# EAGLE design UVBoard (EAGLE 7.4.0)
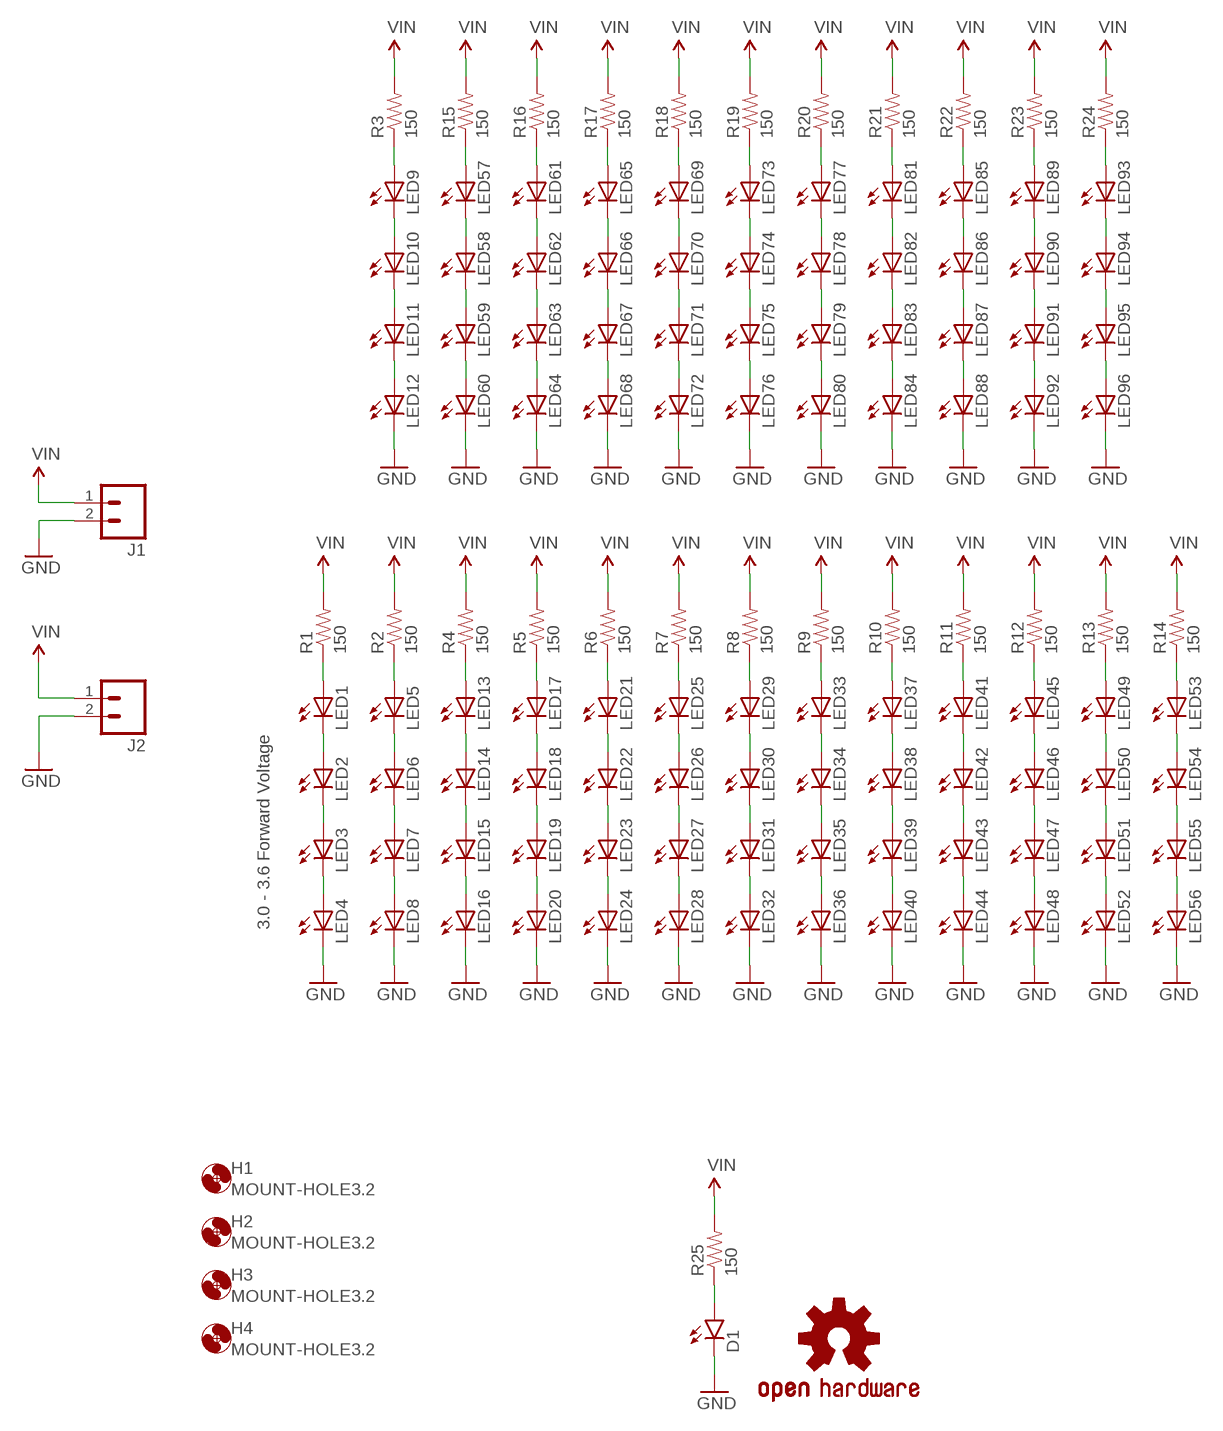
[diagram p0: schematic, sheet 1]

## Parts
D1  LED1206-BOTTOM  [LED-1206-BOTTOM]
H1  MOUNT-HOLE3.2  [3,2]
H2  MOUNT-HOLE3.2  [3,2]
H3  MOUNT-HOLE3.2  [3,2]
H4  MOUNT-HOLE3.2  [3,2]
J1  M023.5MM  [SCREWTERMINAL-3.5MM-2]
J2  M023.5MM  [SCREWTERMINAL-3.5MM-2]
LED1  LEDP-LCC-2  [P-LCC-2]
LED2  LEDP-LCC-2  [P-LCC-2]
LED3  LEDP-LCC-2  [P-LCC-2]
LED4  LEDP-LCC-2  [P-LCC-2]
LED5  LEDP-LCC-2  [P-LCC-2]
LED6  LEDP-LCC-2  [P-LCC-2]
LED7  LEDP-LCC-2  [P-LCC-2]
LED8  LEDP-LCC-2  [P-LCC-2]
LED9  LEDP-LCC-2  [P-LCC-2]
LED10  LEDP-LCC-2  [P-LCC-2]
LED11  LEDP-LCC-2  [P-LCC-2]
LED12  LEDP-LCC-2  [P-LCC-2]
LED13  LEDP-LCC-2  [P-LCC-2]
LED14  LEDP-LCC-2  [P-LCC-2]
LED15  LEDP-LCC-2  [P-LCC-2]
LED16  LEDP-LCC-2  [P-LCC-2]
LED17  LEDP-LCC-2  [P-LCC-2]
LED18  LEDP-LCC-2  [P-LCC-2]
LED19  LEDP-LCC-2  [P-LCC-2]
LED20  LEDP-LCC-2  [P-LCC-2]
LED21  LEDP-LCC-2  [P-LCC-2]
LED22  LEDP-LCC-2  [P-LCC-2]
LED23  LEDP-LCC-2  [P-LCC-2]
LED24  LEDP-LCC-2  [P-LCC-2]
LED25  LEDP-LCC-2  [P-LCC-2]
LED26  LEDP-LCC-2  [P-LCC-2]
LED27  LEDP-LCC-2  [P-LCC-2]
LED28  LEDP-LCC-2  [P-LCC-2]
LED29  LEDP-LCC-2  [P-LCC-2]
LED30  LEDP-LCC-2  [P-LCC-2]
LED31  LEDP-LCC-2  [P-LCC-2]
LED32  LEDP-LCC-2  [P-LCC-2]
LED33  LEDP-LCC-2  [P-LCC-2]
LED34  LEDP-LCC-2  [P-LCC-2]
LED35  LEDP-LCC-2  [P-LCC-2]
LED36  LEDP-LCC-2  [P-LCC-2]
LED37  LEDP-LCC-2  [P-LCC-2]
LED38  LEDP-LCC-2  [P-LCC-2]
LED39  LEDP-LCC-2  [P-LCC-2]
LED40  LEDP-LCC-2  [P-LCC-2]
LED41  LEDP-LCC-2  [P-LCC-2]
LED42  LEDP-LCC-2  [P-LCC-2]
LED43  LEDP-LCC-2  [P-LCC-2]
LED44  LEDP-LCC-2  [P-LCC-2]
LED45  LEDP-LCC-2  [P-LCC-2]
LED46  LEDP-LCC-2  [P-LCC-2]
LED47  LEDP-LCC-2  [P-LCC-2]
LED48  LEDP-LCC-2  [P-LCC-2]
LED49  LEDP-LCC-2  [P-LCC-2]
LED50  LEDP-LCC-2  [P-LCC-2]
LED51  LEDP-LCC-2  [P-LCC-2]
LED52  LEDP-LCC-2  [P-LCC-2]
LED53  LEDP-LCC-2  [P-LCC-2]
LED54  LEDP-LCC-2  [P-LCC-2]
LED55  LEDP-LCC-2  [P-LCC-2]
LED56  LEDP-LCC-2  [P-LCC-2]
LED57  LEDP-LCC-2  [P-LCC-2]
LED58  LEDP-LCC-2  [P-LCC-2]
LED59  LEDP-LCC-2  [P-LCC-2]
LED60  LEDP-LCC-2  [P-LCC-2]
LED61  LEDP-LCC-2  [P-LCC-2]
LED62  LEDP-LCC-2  [P-LCC-2]
LED63  LEDP-LCC-2  [P-LCC-2]
LED64  LEDP-LCC-2  [P-LCC-2]
LED65  LEDP-LCC-2  [P-LCC-2]
LED66  LEDP-LCC-2  [P-LCC-2]
LED67  LEDP-LCC-2  [P-LCC-2]
LED68  LEDP-LCC-2  [P-LCC-2]
LED69  LEDP-LCC-2  [P-LCC-2]
LED70  LEDP-LCC-2  [P-LCC-2]
LED71  LEDP-LCC-2  [P-LCC-2]
LED72  LEDP-LCC-2  [P-LCC-2]
LED73  LEDP-LCC-2  [P-LCC-2]
LED74  LEDP-LCC-2  [P-LCC-2]
LED75  LEDP-LCC-2  [P-LCC-2]
LED76  LEDP-LCC-2  [P-LCC-2]
LED77  LEDP-LCC-2  [P-LCC-2]
LED78  LEDP-LCC-2  [P-LCC-2]
LED79  LEDP-LCC-2  [P-LCC-2]
LED80  LEDP-LCC-2  [P-LCC-2]
LED81  LEDP-LCC-2  [P-LCC-2]
LED82  LEDP-LCC-2  [P-LCC-2]
LED83  LEDP-LCC-2  [P-LCC-2]
LED84  LEDP-LCC-2  [P-LCC-2]
LED85  LEDP-LCC-2  [P-LCC-2]
LED86  LEDP-LCC-2  [P-LCC-2]
LED87  LEDP-LCC-2  [P-LCC-2]
LED88  LEDP-LCC-2  [P-LCC-2]
LED89  LEDP-LCC-2  [P-LCC-2]
LED90  LEDP-LCC-2  [P-LCC-2]
LED91  LEDP-LCC-2  [P-LCC-2]
LED92  LEDP-LCC-2  [P-LCC-2]
LED93  LEDP-LCC-2  [P-LCC-2]
LED94  LEDP-LCC-2  [P-LCC-2]
LED95  LEDP-LCC-2  [P-LCC-2]
LED96  LEDP-LCC-2  [P-LCC-2]
LOGO1  OSHW-LOGOM  [OSHW-LOGO-M]
R1  150  RESISTOR1206  [1206]
R2  150  RESISTOR1206  [1206]
R3  150  RESISTOR1206  [1206]
R4  150  RESISTOR1206  [1206]
R5  150  RESISTOR1206  [1206]
R6  150  RESISTOR1206  [1206]
R7  150  RESISTOR1206  [1206]
R8  150  RESISTOR1206  [1206]
R9  150  RESISTOR1206  [1206]
R10  150  RESISTOR1206  [1206]
R11  150  RESISTOR1206  [1206]
R12  150  RESISTOR1206  [1206]
R13  150  RESISTOR1206  [1206]
R14  150  RESISTOR1206  [1206]
R15  150  RESISTOR1206  [1206]
R16  150  RESISTOR1206  [1206]
R17  150  RESISTOR1206  [1206]
R18  150  RESISTOR1206  [1206]
R19  150  RESISTOR1206  [1206]
R20  150  RESISTOR1206  [1206]
R21  150  RESISTOR1206  [1206]
R22  150  RESISTOR1206  [1206]
R23  150  RESISTOR1206  [1206]
R24  150  RESISTOR1206  [1206]
R25  150  RESISTOR1206  [1206]

## Nets
GND: D1.C J1.2 J2.2 LED4.C LED8.C LED12.C LED16.C LED20.C LED24.C LED28.C LED32.C LED36.C LED40.C LED44.C LED48.C LED52.C LED56.C LED60.C LED64.C LED68.C LED72.C LED76.C LED80.C LED84.C LED88.C LED92.C LED96.C
N$2: LED1.C LED2.A
N$3: LED2.C LED3.A
N$4: LED3.C LED4.A
N$5: LED1.A R1.1
N$6: LED5.C LED6.A
N$7: LED6.C LED7.A
N$8: LED7.C LED8.A
N$9: LED5.A R2.1
N$10: LED9.C LED10.A
N$11: LED10.C LED11.A
N$12: LED11.C LED12.A
N$13: LED9.A R3.1
N$14: LED13.C LED14.A
N$15: LED14.C LED15.A
N$16: LED15.C LED16.A
N$17: LED13.A R4.1
N$18: LED17.C LED18.A
N$19: LED18.C LED19.A
N$20: LED19.C LED20.A
N$21: LED17.A R5.1
N$22: LED21.C LED22.A
N$23: LED22.C LED23.A
N$24: LED23.C LED24.A
N$25: LED21.A R6.1
N$26: LED25.C LED26.A
N$27: LED26.C LED27.A
N$28: LED27.C LED28.A
N$29: LED25.A R7.1
N$30: LED29.C LED30.A
N$31: LED30.C LED31.A
N$32: LED31.C LED32.A
N$33: LED29.A R8.1
N$34: LED33.C LED34.A
N$35: LED34.C LED35.A
N$36: LED35.C LED36.A
N$37: LED33.A R9.1
N$38: LED37.C LED38.A
N$39: LED38.C LED39.A
N$40: LED39.C LED40.A
N$41: LED37.A R10.1
N$42: LED41.C LED42.A
N$43: LED42.C LED43.A
N$44: LED43.C LED44.A
N$45: LED41.A R11.1
N$46: LED45.C LED46.A
N$47: LED46.C LED47.A
N$48: LED47.C LED48.A
N$49: LED45.A R12.1
N$50: LED49.C LED50.A
N$51: LED50.C LED51.A
N$52: LED51.C LED52.A
N$53: LED49.A R13.1
N$54: LED53.C LED54.A
N$55: LED54.C LED55.A
N$56: LED55.C LED56.A
N$57: LED53.A R14.1
N$58: LED57.C LED58.A
N$59: LED58.C LED59.A
N$60: LED59.C LED60.A
N$61: LED57.A R15.1
N$62: LED61.C LED62.A
N$63: LED62.C LED63.A
N$64: LED63.C LED64.A
N$65: LED61.A R16.1
N$66: LED65.C LED66.A
N$67: LED66.C LED67.A
N$68: LED67.C LED68.A
N$69: LED65.A R17.1
N$70: LED69.C LED70.A
N$71: LED70.C LED71.A
N$72: LED71.C LED72.A
N$73: LED69.A R18.1
N$74: LED73.C LED74.A
N$75: LED74.C LED75.A
N$76: LED75.C LED76.A
N$77: LED73.A R19.1
N$78: LED77.C LED78.A
N$79: LED78.C LED79.A
N$80: LED79.C LED80.A
N$81: LED77.A R20.1
N$82: LED81.C LED82.A
N$83: LED82.C LED83.A
N$84: LED83.C LED84.A
N$85: LED81.A R21.1
N$86: LED85.C LED86.A
N$87: LED86.C LED87.A
N$88: LED87.C LED88.A
N$89: LED85.A R22.1
N$90: LED89.C LED90.A
N$91: LED90.C LED91.A
N$92: LED91.C LED92.A
N$93: LED89.A R23.1
N$94: LED93.C LED94.A
N$95: LED94.C LED95.A
N$96: LED95.C LED96.A
N$97: LED93.A R24.1
N$98: D1.A R25.1
VIN: J1.1 J2.1 R1.2 R2.2 R3.2 R4.2 R5.2 R6.2 R7.2 R8.2 R9.2 R10.2 R11.2 R12.2 R13.2 R14.2 R15.2 R16.2 R17.2 R18.2 R19.2 R20.2 R21.2 R22.2 R23.2 R24.2 R25.2

## Notes on the sheet
- 3.0 - 3.6 Forward Voltage

## Library data of the parts
D1 = SparkFun-LED:LED: LEDs Standard schematic elements and footprints for 5mm, 3mm, 1206, and 0603 sized LEDs. 5mm - Spark Fun Electronics SKU : COM-00529 (and others)
H1-H4 = holes:MOUNT-HOLE: MOUNTING HOLE with drill center marker
J1 J2 = SparkFun-Connectors:M02: Standard 2-pin 0.1" header. Use with - straight break away headers ( PRT-00116) - right angle break away headers (PRT-00553) - swiss pins (PRT-00743) - machine pins (PRT-00117) - female headers (PRT-00115) Molex polarized connector foot print use with: PRT-08233 with associated crimp pins and housings. 2.54_SCREWTERM for use with PRT-10571. 3.5mm Screw Terminal footprints for PRT-08084 5mm Screw Terminal footprints for use with PRT-08432; PROD_ID: CONN-08399
LED1-LED96 = led:LED: LED OSRAM: - CHIPLED LG R971, LG N971, LY N971, LG Q971, LY Q971, LO R971, LY R971 LH N974, LH R974 LS Q976, LO Q976, LY Q976 LO Q996 - Hyper CHIPLED LW Q18S LB Q993, LB Q99A, LB R99A - SideLED LS A670, LO A670, LY A670, LG A670, LP A670 LB A673, LV A673, LT A673, LW A673 LH A674 LY A675 LS A676, LA A676, LO A676, LY A676, LW A676 LS A679, LY A679, LG A679 - Hyper Micro SIDELED® LS Y876, LA Y876, LO Y876, LY Y876 LT Y87S - SmartLED LW L88C, LW L88S LB L89C, LB L89S, LG L890 LS L89K, LO L89K, LY L89K LS L896, LA L896, LO L896, LY L896 - TOPLED LS T670, LO T670, LY T670, LG T670, LP T670 LSG T670, LSP T670, LSY T670, LOP T670, LYG T670 LG T671, LOG T671, LSG T671 LB T673, LV T673, LT T673, LW T673 LH T674 LS T676, LA T676, LO T676, LY T676, LB T676, LH T676, LSB T676, LW T676 LB T67C, LV T67C, LT T67C, LS T67K, LO T67K, LY T67K, LW E67C LS E67B, LA E67B, LO E67B, LY E67B, LB E67C, LV E67C, LT E67C LW T67C LS T679, LY T679, LG T679 LS T770, LO T770, LY T770, LG T770, LP T770 LB T773, LV T773, LT T773, LW T773 LH T774 LS E675, LA E675, LY E675, LS T675 LS T776, LA T776, LO T776, LY T776, LB T776 LHGB T686 LT T68C, LB T68C - Hyper Mini TOPLED® LB M676 - Mini TOPLED Santana® LG M470 LS M47K, LO M47K, LY M47K Source: http://www.osram.convergy.de LUXEON: - LUMILED® LXK2-PW12-R00, LXK2-PW12-S00, LXK2-PW14-U00, LXK2-PW14-V00 LXK2-PM12-R00, LXK2-PM12-S00, LXK2-PM14-U00 LXK2-PE12-Q00, LXK2-PE12-R00, LXK2-PE12-S00, LXK2-PE14-T00, LXK2-PE14-U00 LXK2-PB12-K00, LXK2-PB12-L00, LXK2-PB12-M00, LXK2-PB14-N00, LXK2-PB14-P00, LXK2-PB14-Q00 LXK2-PR12-L00, LXK2-PR12-M00, LXK2-PR14-Q00, LXK2-PR14-R00 LXK2-PD12-Q00, LXK2-PD12-R00, LXK2-PD12-S00 LXK2-PH12-R00, LXK2-PH12-S00 LXK2-PL12-P00, LXK2-PL12-Q00, LXK2-PL12-R00 Source: www.luxeon.com KINGBRIGHT: KA-3528ASYC Source: www.kingbright.com
LOGO1 = Spark:OSHW-LOGO: Open Source Hardware Logo This logo indicates the piece of hardware it is found on incorporates a OSHW license and/or adheres to the definition of open source hardware found here: http://freedomdefined.org/OSHW
R1-R25 = SparkFun-Passives:RESISTOR: Resistor Basic schematic elements and footprints for 0603, 1206, and PTH resistors.

## Board
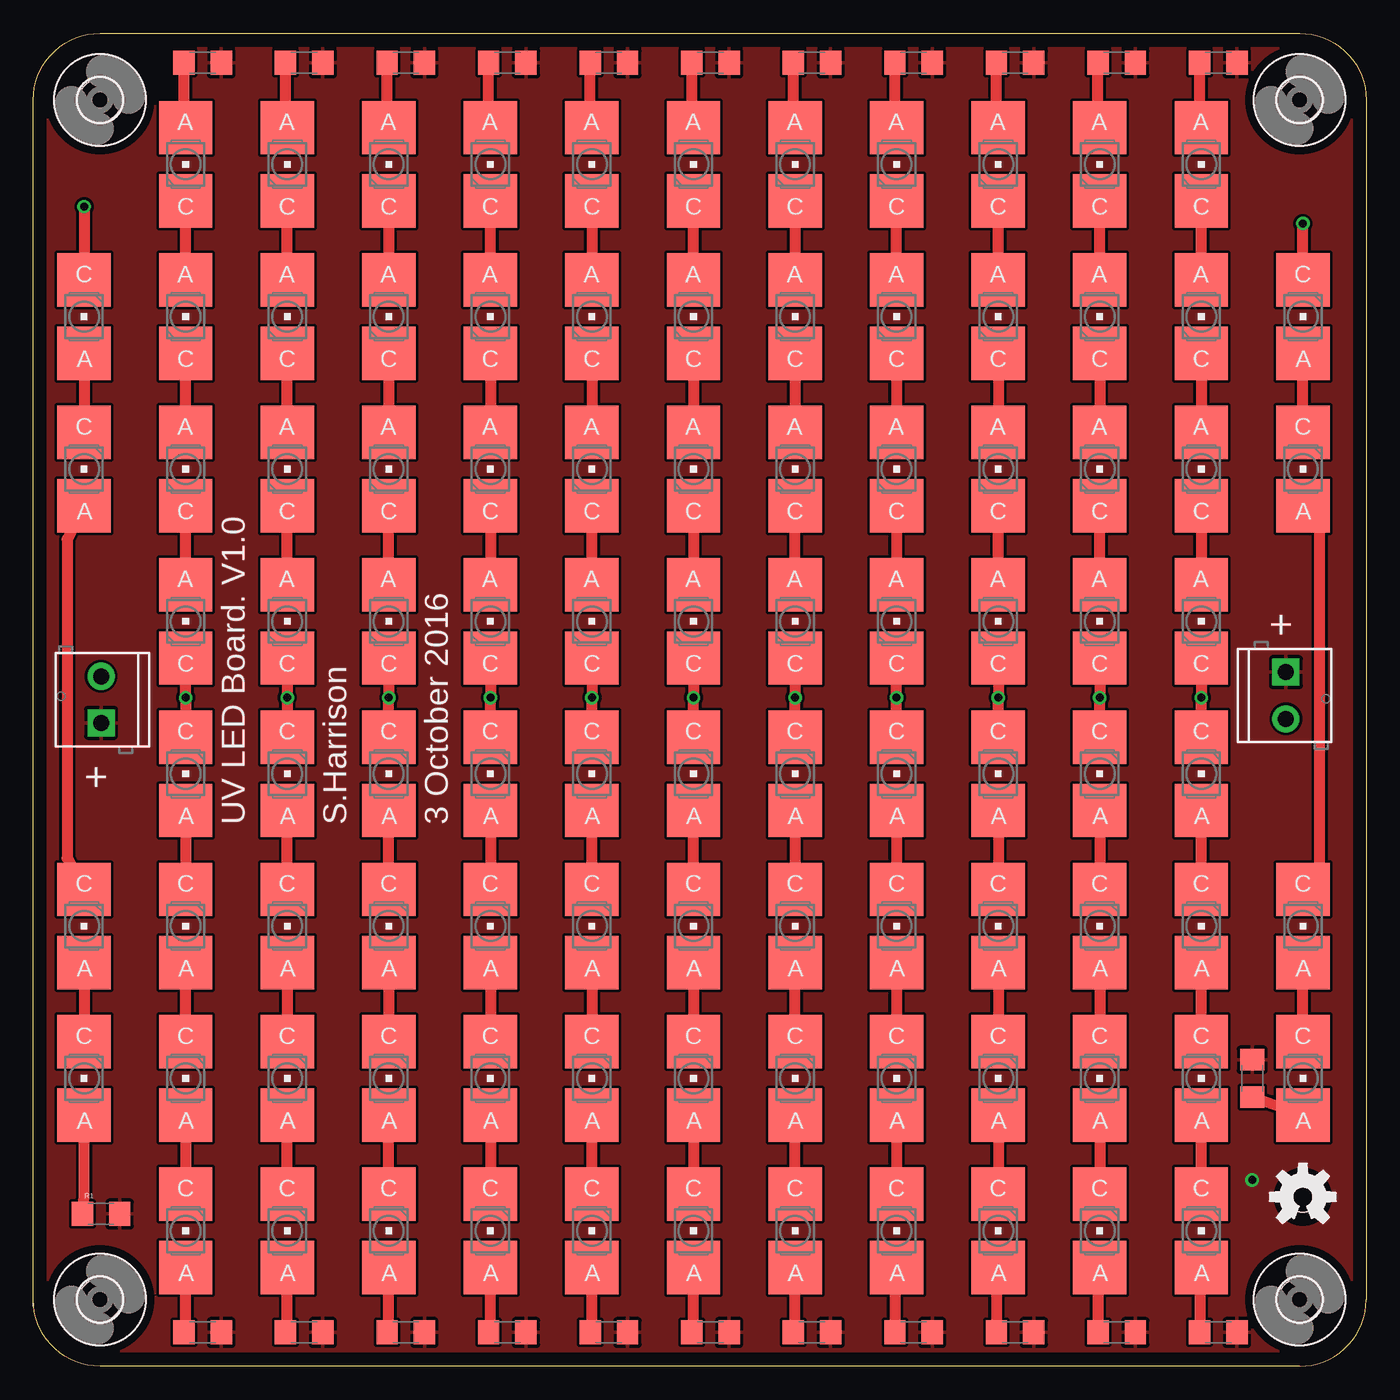
[diagram p1: board, top side]
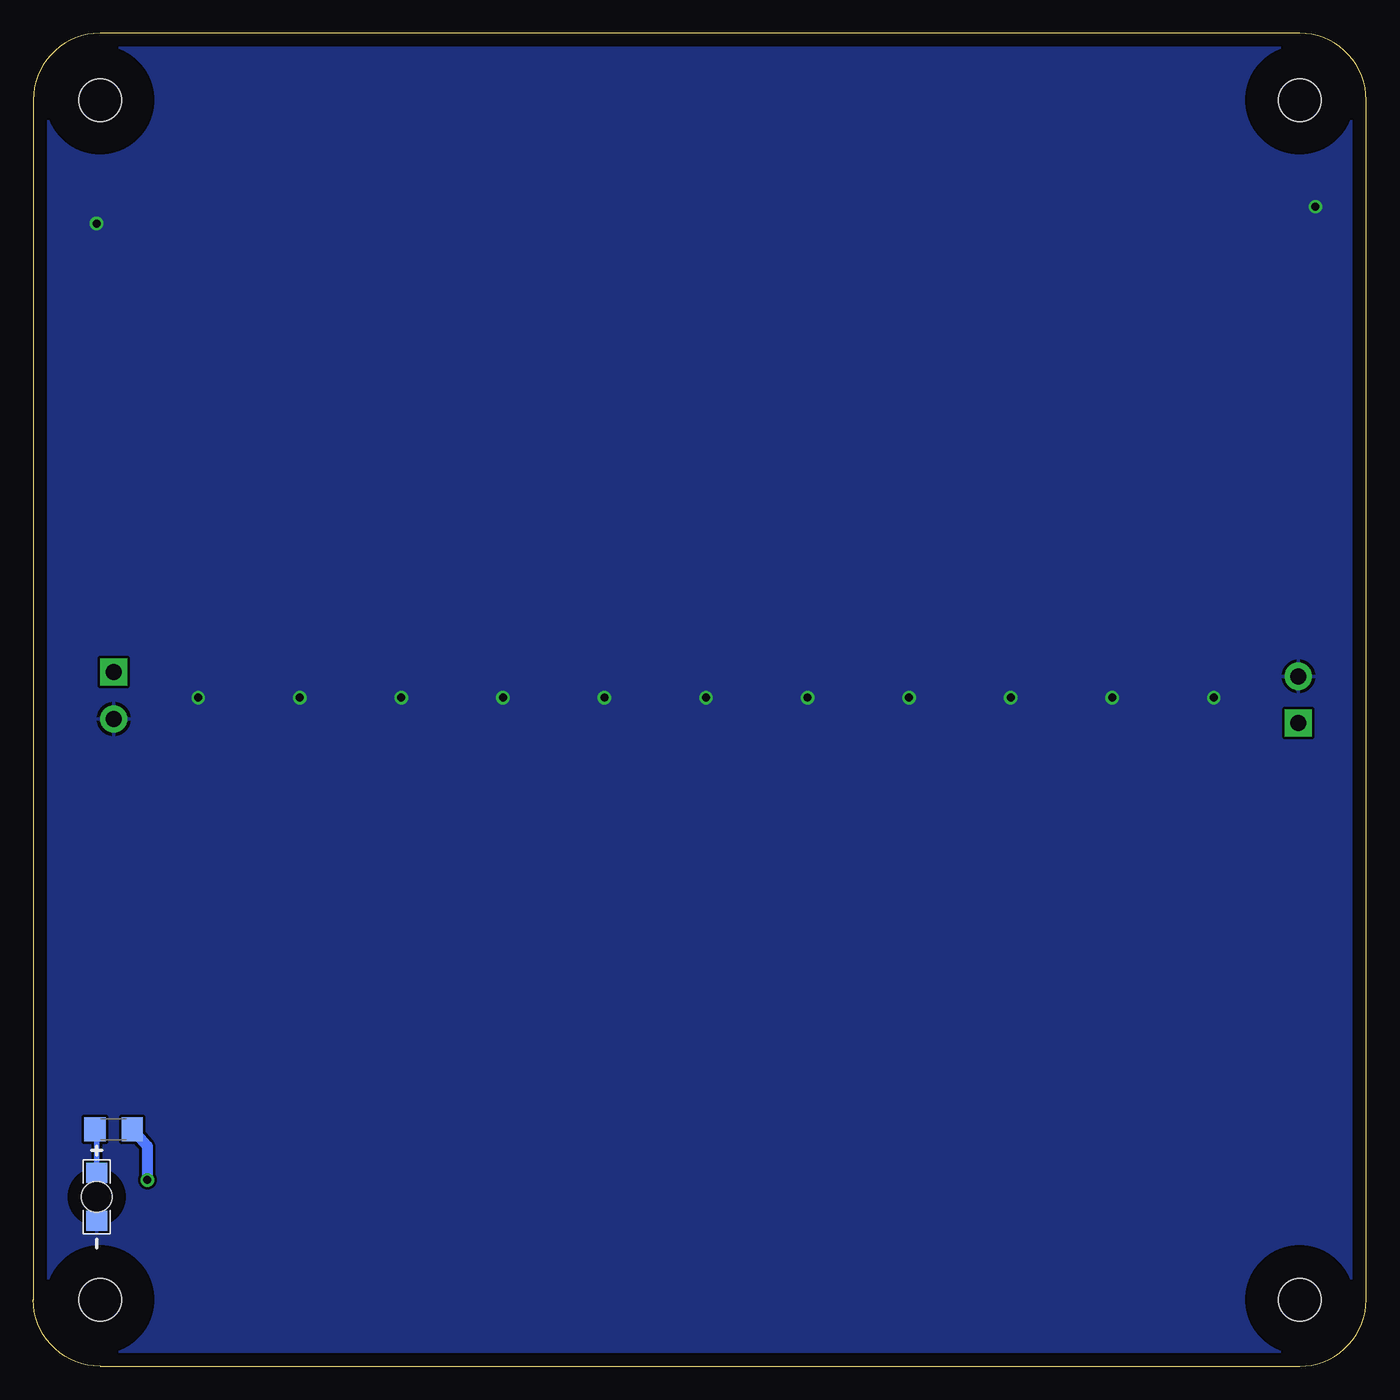
[diagram p2: board, bottom side, seen from below]

Size 100 x 100 mm. Coordinates in mm from the lower left corner, seen from the top.
Outline: 5,100 95,100 arc-90 100,95 100,5 arc-90 95,0 5,0 arc-90 0,5 0,95 arc-90 5,100
Copper layers (1*16): Top 0.035mm / dielectric 1.5mm / Bottom 0.035mm
Design rules "default": minimum track width 10mil, minimum drill 24mil, track to track 8mil, track to pad 8mil, pad to pad 8mil, via to via 8mil, smd to smd 8mil, copper to edge 40mil, drill to drill 8mil, minimum pad ring 10mil, minimum via ring 8mil, stop-mask expansion 4mil, vias tented up to drill 0mil, thermal gap 10mil

### Footprints (pad centres in the part's own frame; a part is rotated, then mirrored left to right if it is on the bottom)
LED-1206-BOTTOM = smd 1.5 x 1.6: A -1.8,0; C 1.8,0 | hole 2.3: 0,0
3,2 = hole 3.2: 0,0
SCREWTERMINAL-3.5MM-2 = drill 1.2 pad 2.032 square: 1 0,0 | drill 1.2 pad 2.032: 2 3.5,0
P-LCC-2 = smd 4 x 4: A 0,2.75; C 0,-2.75
1206 = smd 1.6 x 1.8: 1 -1.4,0; 2 1.4,0

### Placement (x,y rotation side)
D1  95.25,12.7 270 bottom
H1  5,5 0 top
H2  95,5 0 top
H3  5,95 0 top
H4  95,95 0 top
J1  5.08,48.26 90 top
J2  93.98,52.07 270 top
LED1  3.81,21.59 180 top
LED2  3.81,33.02 180 top
LED3  3.81,67.31 180 top
LED4  3.81,78.74 180 top
LED5  11.43,10.16 180 top
LED6  11.43,21.59 180 top
LED7  11.43,33.02 180 top
LED8  11.43,44.45 180 top
LED9  11.43,90.17 0 top
LED10  11.43,78.74 0 top
LED11  11.43,67.31 0 top
LED12  11.43,55.88 0 top
LED13  19.05,10.16 180 top
LED14  19.05,21.59 180 top
LED15  19.05,33.02 180 top
LED16  19.05,44.45 180 top
LED17  26.67,10.16 180 top
LED18  26.67,21.59 180 top
LED19  26.67,33.02 180 top
LED20  26.67,44.45 180 top
LED21  34.29,10.16 180 top
LED22  34.29,21.59 180 top
LED23  34.29,33.02 180 top
LED24  34.29,44.45 180 top
LED25  41.91,10.16 180 top
LED26  41.91,21.59 180 top
LED27  41.91,33.02 180 top
LED28  41.91,44.45 180 top
LED29  49.53,10.16 180 top
LED30  49.53,21.59 180 top
LED31  49.53,33.02 180 top
LED32  49.53,44.45 180 top
LED33  57.15,10.16 180 top
LED34  57.15,21.59 180 top
LED35  57.15,33.02 180 top
LED36  57.15,44.45 180 top
LED37  64.77,10.16 180 top
LED38  64.77,21.59 180 top
LED39  64.77,33.02 180 top
LED40  64.77,44.45 180 top
LED41  72.39,10.16 180 top
LED42  72.39,21.59 180 top
LED43  72.39,33.02 180 top
LED44  72.39,44.45 180 top
LED45  80.01,10.16 180 top
LED46  80.01,21.59 180 top
LED47  80.01,33.02 180 top
LED48  80.01,44.45 180 top
LED49  87.63,10.16 180 top
LED50  87.63,21.59 180 top
LED51  87.63,33.02 180 top
LED52  87.63,44.45 180 top
LED53  95.25,21.59 180 top
LED54  95.25,33.02 180 top
LED55  95.25,67.31 180 top
LED56  95.25,78.74 180 top
LED57  19.05,90.17 0 top
LED58  19.05,78.74 0 top
LED59  19.05,67.31 0 top
LED60  19.05,55.88 0 top
LED61  26.67,90.17 0 top
LED62  26.67,78.74 0 top
LED63  26.67,67.31 0 top
LED64  26.67,55.88 0 top
LED65  34.29,90.17 0 top
LED66  34.29,78.74 0 top
LED67  34.29,67.31 0 top
LED68  34.29,55.88 0 top
LED69  41.91,90.17 0 top
LED70  41.91,78.74 0 top
LED71  41.91,67.31 0 top
LED72  41.91,55.88 0 top
LED73  49.53,90.17 0 top
LED74  49.53,78.74 0 top
LED75  49.53,67.31 0 top
LED76  49.53,55.88 0 top
LED77  57.15,90.17 0 top
LED78  57.15,78.74 0 top
LED79  57.15,67.31 0 top
LED80  57.15,55.88 0 top
LED81  64.77,90.17 0 top
LED82  64.77,78.74 0 top
LED83  64.77,67.31 0 top
LED84  64.77,55.88 0 top
LED85  72.39,90.17 0 top
LED86  72.39,78.74 0 top
LED87  72.39,67.31 0 top
LED88  72.39,55.88 0 top
LED89  80.01,90.17 0 top
LED90  80.01,78.74 0 top
LED91  80.01,67.31 0 top
LED92  80.01,55.88 0 top
LED93  87.63,90.17 0 top
LED94  87.63,78.74 0 top
LED95  87.63,67.31 0 top
LED96  87.63,55.88 0 top
LOGO1  95.25,12.7 0 top
R1  5.08,11.43 0 top
R2  12.7,2.54 0 top
R3  12.7,97.79 0 top
R4  20.32,2.54 0 top
R5  27.94,2.54 0 top
R6  35.56,2.54 0 top
R7  43.18,2.54 0 top
R8  50.8,2.54 0 top
R9  58.42,2.54 0 top
R10  66.04,2.54 0 top
R11  73.66,2.54 0 top
R12  81.28,2.54 0 top
R13  88.9,2.54 0 top
R14  91.44,21.59 90 top
R15  20.32,97.79 0 top
R16  27.94,97.79 0 top
R17  35.56,97.79 0 top
R18  43.18,97.79 0 top
R19  50.8,97.79 0 top
R20  58.42,97.79 0 top
R21  66.04,97.79 0 top
R22  73.66,97.79 0 top
R23  81.28,97.79 0 top
R24  88.9,97.79 0 top
R25  93.98,17.78 0 bottom

### Tracks (layer width: path | path; a pad name or v marks a point on that pad's centre or on a via)
GND  (via drill 0.6)
  Top 0.813: v3.81,87 LED4.C | LED8.C v11.43,50.16 LED12.C | LED16.C v19.05,50.16 LED60.C | LED20.C v26.67,50.16 LED64.C | LED24.C v34.29,50.16 LED68.C | LED28.C v41.91,50.16 LED72.C | LED32.C v49.53,50.16 LED76.C | LED36.C v57.15,50.16 LED80.C | LED40.C v64.77,50.16 LED84.C | LED44.C v72.39,50.16 LED88.C | LED48.C v80.01,50.16 LED92.C | LED52.C v87.63,50.16 LED96.C 87.63,53.34 | LED56.C v95.25,85.72
  pour Bottom: -1.27,-1.27 101.6,-1.27 101.6,101.6 -1.27,101.6
N$2
  Top 0.813: LED2.A LED1.C
N$3
  Top 0.813: LED3.A 2.54,62.02 2.54,38.1 LED2.C
N$4
  Top 0.813: LED4.A LED3.C
N$5
  Top 0.813: R1.1 3.81,12.7 LED1.A
N$6
  Top 0.813: LED6.A LED5.C
N$7
  Top 0.813: LED6.C LED7.A
N$8
  Top 0.813: LED8.A LED7.C
N$9
  Top 0.813: R2.1 11.43,2.54 LED5.A
N$10
  Top 0.813: LED10.A LED9.C
N$11
  Top 0.813: LED11.A LED10.C
N$12
  Top 0.813: LED12.A LED11.C
N$13
  Top 0.813: LED9.A 11.3,92.92 R3.1
N$14
  Top 0.813: LED13.C LED14.A
N$15
  Top 0.813: LED15.A LED14.C
N$16
  Top 0.813: LED15.C LED16.A
N$17
  Top 0.813: R4.1 19.05,2.54 LED13.A
N$18
  Top 0.813: LED17.C LED18.A
N$19
  Top 0.813: LED19.A LED18.C
N$20
  Top 0.813: LED19.C LED20.A
N$21
  Top 0.813: R5.1 26.67,2.54 LED17.A
N$22
  Top 0.813: LED22.A LED21.C
N$23
  Top 0.813: LED23.A LED22.C
N$24
  Top 0.813: LED24.A LED23.C
N$25
  Top 0.813: R6.1 34.29,2.54 LED21.A
N$26
  Top 0.813: LED25.C LED26.A
N$27
  Top 0.813: LED27.A LED26.C
N$28
  Top 0.813: LED27.C LED28.A 41.91,41.91
N$29
  Top 0.813: R7.1 41.91,2.54 LED25.A
N$30
  Top 0.813: LED30.A LED29.C
N$31
  Top 0.813: LED31.A LED30.C
N$32
  Top 0.813: LED31.C LED32.A
N$33
  Top 0.813: R8.1 49.53,2.54 LED29.A
N$34
  Top 0.813: LED33.C LED34.A
N$35
  Top 0.813: LED34.C LED35.A
N$36
  Top 0.813: LED36.A LED35.C
N$37
  Top 0.813: R9.1 57.15,2.54 LED33.A
N$38
  Top 0.813: LED38.A LED37.C
N$39
  Top 0.813: LED39.A LED38.C
N$40
  Top 0.813: LED40.A LED39.C
N$41
  Top 0.813: LED37.A 64.64,7.41 R10.1
N$42
  Top 0.813: LED42.A LED41.C
N$43
  Top 0.813: LED43.A LED42.C
N$44
  Top 0.813: LED44.A LED43.C
N$45
  Top 0.813: LED41.A 72.26,7.41 R11.1
N$46
  Top 0.813: LED46.A LED45.C
N$47
  Top 0.813: LED47.A LED46.C 80.01,24.13
N$48
  Top 0.813: LED48.A LED47.C
N$49
  Top 0.813: LED45.A 79.88,7.41 R12.1
N$50
  Top 0.813: LED49.C LED50.A
N$51
  Top 0.813: LED50.C LED51.A
N$52
  Top 0.813: LED51.C LED52.A
N$53
  Top 0.813: LED49.A 87.5,7.41 R13.1
N$54
  Top 0.813: LED53.C LED54.A
N$55
  Top 0.813: LED54.C 96.52,36.83 96.52,63.29 LED55.A
N$56
  Top 0.813: LED55.C LED56.A
N$57
  Top 0.813: R14.1 LED53.A
N$58
  Top 0.813: LED58.A LED57.C
N$59
  Top 0.813: LED59.A LED58.C
N$60
  Top 0.813: LED60.A LED59.C
N$61
  Top 0.813: LED57.A 18.92,92.92 R15.1
N$62
  Top 0.813: LED61.C LED62.A
N$63
  Top 0.813: LED62.C LED63.A
N$64
  Top 0.813: LED64.A LED63.C
N$65
  Top 0.813: LED61.A 26.54,92.92 R16.1
N$66
  Top 0.813: LED66.A LED65.C
N$67
  Top 0.813: LED66.C LED67.A
N$68
  Top 0.813: LED67.C LED68.A
N$69
  Top 0.813: LED65.A 34.16,92.92 R17.1
N$70
  Top 0.813: LED69.C LED70.A 41.91,81.28
N$71
  Top 0.813: LED70.C LED71.A
N$72
  Top 0.813: LED72.A LED71.C
N$73
  Top 0.813: LED69.A 41.78,92.92 R18.1
N$74
  Top 0.813: LED74.A LED73.C
N$75
  Top 0.813: LED74.C LED75.A
N$76
  Top 0.813: LED75.C LED76.A
N$77
  Top 0.813: LED73.A 49.4,92.92 R19.1
N$78
  Top 0.813: LED77.C LED78.A
N$79
  Top 0.813: LED78.C LED79.A
N$80
  Top 0.813: LED80.A LED79.C
N$81
  Top 0.813: LED77.A 57.02,92.92 R20.1
N$82
  Top 0.813: LED82.A LED81.C
N$83
  Top 0.813: LED82.C LED83.A
N$84
  Top 0.813: LED83.C LED84.A
N$85
  Top 0.813: LED81.A 64.64,92.92 R21.1
N$86
  Top 0.813: LED86.A LED85.C
N$87
  Top 0.813: LED86.C LED87.A
N$88
  Top 0.813: LED88.A LED87.C
N$89
  Top 0.813: LED85.A 72.26,92.92 R22.1
N$90
  Top 0.813: LED90.A LED89.C
N$91
  Top 0.813: LED90.C LED91.A
N$92
  Top 0.813: LED92.A LED91.C
N$93
  Top 0.813: LED89.A 79.88,92.92 R23.1
N$94
  Top 0.813: LED94.A LED93.C
N$95
  Top 0.813: LED94.C LED95.A
N$96
  Top 0.813: LED95.C LED96.A
N$97
  Top 0.813: LED93.A 87.5,92.92 R24.1
N$98
  Bottom 0.406: R25.1 95.25,17.78 D1.A
VIN  (via drill 0.6)
  Bottom 0.813: R25.2 91.44,16.51 v91.44,13.97
  pour Top: 0,100.33 0,-1.27 100.33,-1.27 100.33,100.33

### Text on the board
tNames: + | + | UV LED Board. V1.0 | S.Harrison | 3 October 2016